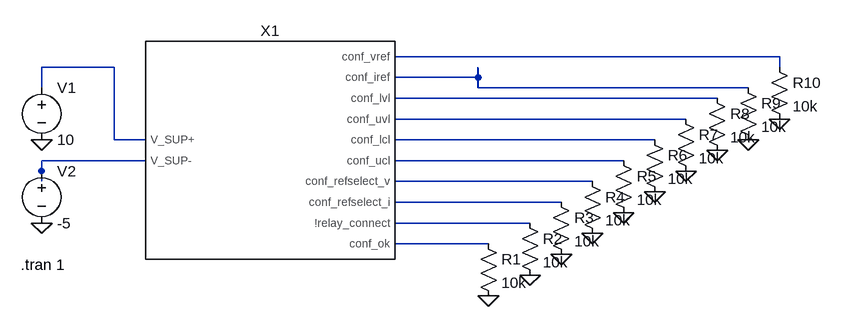
[diagram p0: schematic sim_conf.asc]
sim_conf.asc, the LTspice schematic file:
Version 4
SHEET 1 1012 680
WIRE 944 32 352 32
WIRE -80 48 -192 48
WIRE 944 48 944 32
WIRE 480 64 480 48
WIRE 480 64 352 64
WIRE -192 80 -192 48
WIRE 480 80 480 64
WIRE 896 80 480 80
WIRE 848 96 352 96
WIRE 800 128 352 128
WIRE -80 160 -80 48
WIRE -32 160 -80 160
WIRE 752 160 352 160
WIRE -32 192 -192 192
WIRE 704 192 352 192
WIRE -192 208 -192 192
WIRE -192 224 -192 208
WIRE 656 224 352 224
WIRE 608 256 352 256
WIRE 560 288 352 288
WIRE 496 320 352 320
FLAG -192 160 0
FLAG -192 288 0
FLAG 496 400 0
FLAG 560 368 0
FLAG 608 336 0
FLAG 656 304 0
FLAG 704 272 0
FLAG 752 240 0
FLAG 800 208 0
FLAG 848 176 0
FLAG 896 160 0
FLAG 944 128 0
SYMBOL conf 160 176 R0
SYMATTR InstName X1
SYMBOL voltage -192 64 R0
WINDOW 123 0 0 Left 0
WINDOW 39 0 0 Left 0
SYMATTR InstName V1
SYMATTR Value 10
SYMBOL voltage -192 192 R0
WINDOW 123 0 0 Left 0
WINDOW 39 0 0 Left 0
SYMATTR InstName V2
SYMATTR Value -5
SYMBOL res 480 304 R0
SYMATTR InstName R1
SYMATTR Value 10k
SYMBOL res 544 272 R0
SYMATTR InstName R2
SYMATTR Value 10k
SYMBOL res 592 240 R0
SYMATTR InstName R3
SYMATTR Value 10k
SYMBOL res 640 208 R0
SYMATTR InstName R4
SYMATTR Value 10k
SYMBOL res 688 176 R0
SYMATTR InstName R5
SYMATTR Value 10k
SYMBOL res 736 144 R0
SYMATTR InstName R6
SYMATTR Value 10k
SYMBOL res 784 112 R0
SYMATTR InstName R7
SYMATTR Value 10k
SYMBOL res 832 80 R0
SYMATTR InstName R8
SYMATTR Value 10k
SYMBOL res 880 64 R0
SYMATTR InstName R9
SYMATTR Value 10k
SYMBOL res 928 32 R0
SYMATTR InstName R10
SYMATTR Value 10k
TEXT -224 352 Left 2 !.tran 1

The netlist it stands for:
* sim_conf.asc
XX1 N002 N007 N011 N003 N006 N004 N012 N010 N009 N008 N005 N001 conf  ; pins V_SUP+ V_SUP- !relay_connect conf_iref conf_lcl conf_lvl conf_ok conf_refselect_i conf_refselect_v conf_ucl conf_uvl conf_vref
V1 N002 0 10
V2 N007 0 -5
R1 N012 0 10k
R2 N011 0 10k
R3 N010 0 10k
R4 N009 0 10k
R5 N008 0 10k
R6 N006 0 10k
R7 N005 0 10k
R8 N004 0 10k
R9 N003 0 10k
R10 N001 0 10k
.tran 1
.backanno
.end